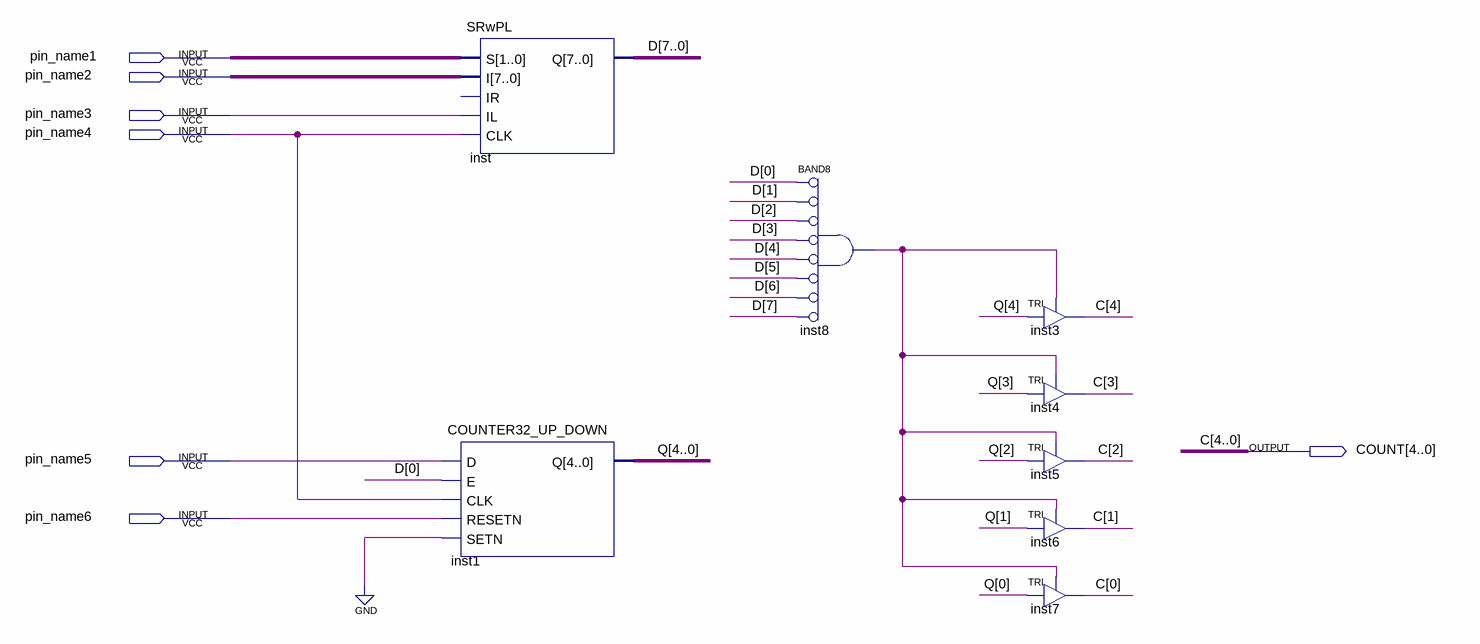
[diagram p0: schematic sheet]
// Quartus schematic One_Counter.bdf as structural Verilog: 8 symbols, 7 pins
module One_Counter (
  input  pin_name1,
  input  pin_name2,
  input  pin_name3,
  input  pin_name4,
  input  pin_name5,
  input  pin_name6,
  output [4:0] COUNT
);

  wire inst8_out;
  wire [1:0] undriven;
  wire [4:0] Q;
  wire [7:0] D, undriven_2;

  COUNTER32_UP_DOWN inst1 (.D(pin_name5), .E(D[0]), .CLK(pin_name4), .RESETN(pin_name6), .SETN(1'b0), .Q(Q));
  SRwPL inst (.S(undriven), .I(undriven_2), .IL(pin_name3), .CLK(pin_name4), .Q(D));  // open: IR
  and inst8 (inst8_out, ~D[0], ~D[1], ~D[2], ~D[3], ~D[4], ~D[5], ~D[6], ~D[7]);  // BAND8
  TRI inst3 (.IN(Q[4]), .OE(inst8_out), .OUT(COUNT[4]));
  TRI inst4 (.IN(Q[3]), .OE(inst8_out), .OUT(COUNT[3]));
  TRI inst5 (.IN(Q[2]), .OE(inst8_out), .OUT(COUNT[2]));
  TRI inst6 (.IN(Q[1]), .OE(inst8_out), .OUT(COUNT[1]));
  TRI inst7 (.IN(Q[0]), .OE(inst8_out), .OUT(COUNT[0]));

  // Other names for the same wires on the sheet: C[4:0] = COUNT
endmodule
